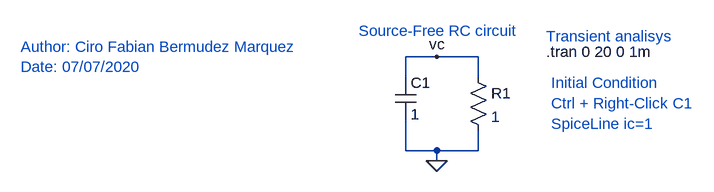
[diagram p0: schematic Source-Free_RC.asc]
Source-Free_RC.asc, the LTspice schematic file:
Version 4
SHEET 1 880 680
WIRE 128 112 80 112
WIRE 192 112 128 112
WIRE 80 144 80 112
WIRE 192 144 192 112
WIRE 80 256 80 208
WIRE 128 256 80 256
WIRE 192 256 192 224
WIRE 192 256 128 256
WIRE 128 272 128 256
FLAG 128 272 0
FLAG 128 112 vc
SYMBOL res 176 128 R0
SYMATTR InstName R1
SYMATTR Value 1
SYMBOL cap 64 144 R0
SYMATTR InstName C1
SYMATTR Value 1
SYMATTR SpiceLine ic=1
TEXT 296 104 Left 2 !.tran 0 20 0 1m
TEXT 304 152 Left 2 ;Initial Condition\nCtrl + Right-Click C1\nSpiceLine ic=1
TEXT 8 72 Left 2 ;Source-Free RC circuit
TEXT 296 80 Left 2 ;Transient analisys
TEXT -512 96 Left 2 ;Author: Ciro Fabian Bermudez Marquez\nDate: 07/07/2020

The netlist it stands for:
* Source-Free_RC.asc
R1 vc 0 1
C1 vc 0 1 ic=1
.tran 0 20 0 1m
* Initial Condition
* Ctrl + Right-Click C1
* SpiceLine ic=1
* Source-Free RC circuit
* Transient analisys
* Author: Ciro Fabian Bermudez Marquez
* Date: 07/07/2020
.backanno
.end